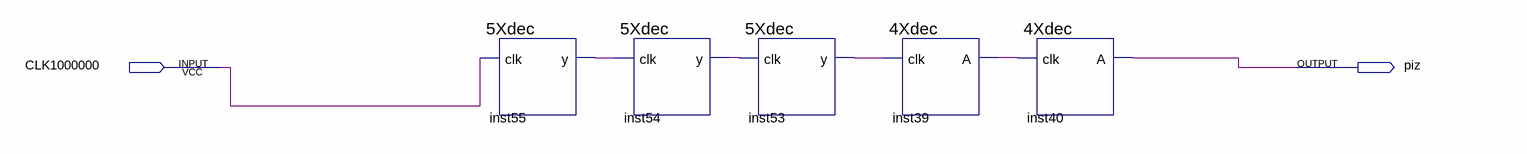
[diagram p0: schematic sheet]
// Quartus schematic FPGA2-3-1.bdf as structural Verilog: 5 symbols, 2 pins
module \FPGA2-3-1  (
  input  CLK1000000,
  output piz
);

  wire inst39_a, inst53_y, inst54_y, inst55_y;

  \5Xdec  inst55 (.clk(CLK1000000), .y(inst55_y));
  \5Xdec  inst54 (.clk(inst55_y), .y(inst54_y));
  \5Xdec  inst53 (.clk(inst54_y), .y(inst53_y));
  \4Xdec  inst39 (.clk(inst53_y), .A(inst39_a));
  \4Xdec  inst40 (.clk(inst39_a), .A(piz));
endmodule
